# EAGLE design CCR2 (EAGLE 7.1.0)
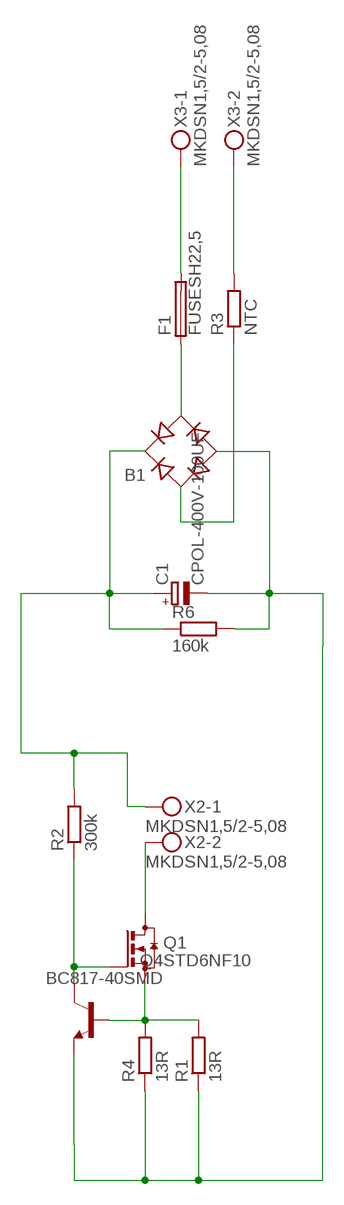
[diagram p0: schematic, sheet 1]

## Parts
B1  RB1A  [RB1A]
C1  CPOL-400V-100UF  [18*36.5_7.62]
F1  FUSESH22,5  [SH22,5]
Q1  STD6NF10  [DPAK]
Q4  BC817-40SMD  [SOT23-BEC]
R1  13R  R-EU_0411/12  [0411/12]
R2  300k  R-EU_0411/12  [0411/12]
R3  NTC  R-EU_0309/10  [0309/10]
R4  13R  R-EU_0411/12  [0411/12]
R6  160k  R-EU_0204/7  [0204/7]
X2  MKDSN1,5/2-5,08  [MKDSN1,5/2-5,08]
X3  MKDSN1,5/2-5,08  [MKDSN1,5/2-5,08]

## Nets
GND: B1.- C1.P$1(-) Q4.E R1.1 R4.1 R6.2
N$1: B1.+ C1.P$2(+) R2.2 R6.1 X2.1
N$2: R3.2 X3.2
N$3: Q1.S Q4.B R1.2 R4.2
N$4: Q1.D X2.2
N$5: F1.2 X3.1
N$6: B1.AC2 F1.1
N$8: Q1.G Q4.C R2.1
N$11: B1.AC1 R3.1

## Library data of the parts
B1 = rectifier:RB1A: RECTIFIER 1 A
C1 = Namenlos:CPOL-400V-100UF
F1 = fuse:FUSE: Fuse; OC_FARNELL: unknown; OC_NEWARK: unknown
Q1 = Namenlos:STD6NF10
Q4 = transistor-npn:BC817*: NPN Transistor
R1-R4 R6 = rcl:R-EU_: RESISTOR, European symbol
X2 X3 = con-phoenix-508:MKDSN1,5/2-5,08: MKDSN 1,5/ 2-5,08 Printklemme Nennstrom: 13,5 A Nennspannung: 250 V Rastermaß: 5,08 mm Polzahl: 2 Anschlussart: Schraubanschluss Montage: Löten Anschlussrichtung Leiter/Platine: 0 ° Artikelnummer: 1729128 Source: http://eshop.phoenixcontact.com .. 1729128.pdf

## Board
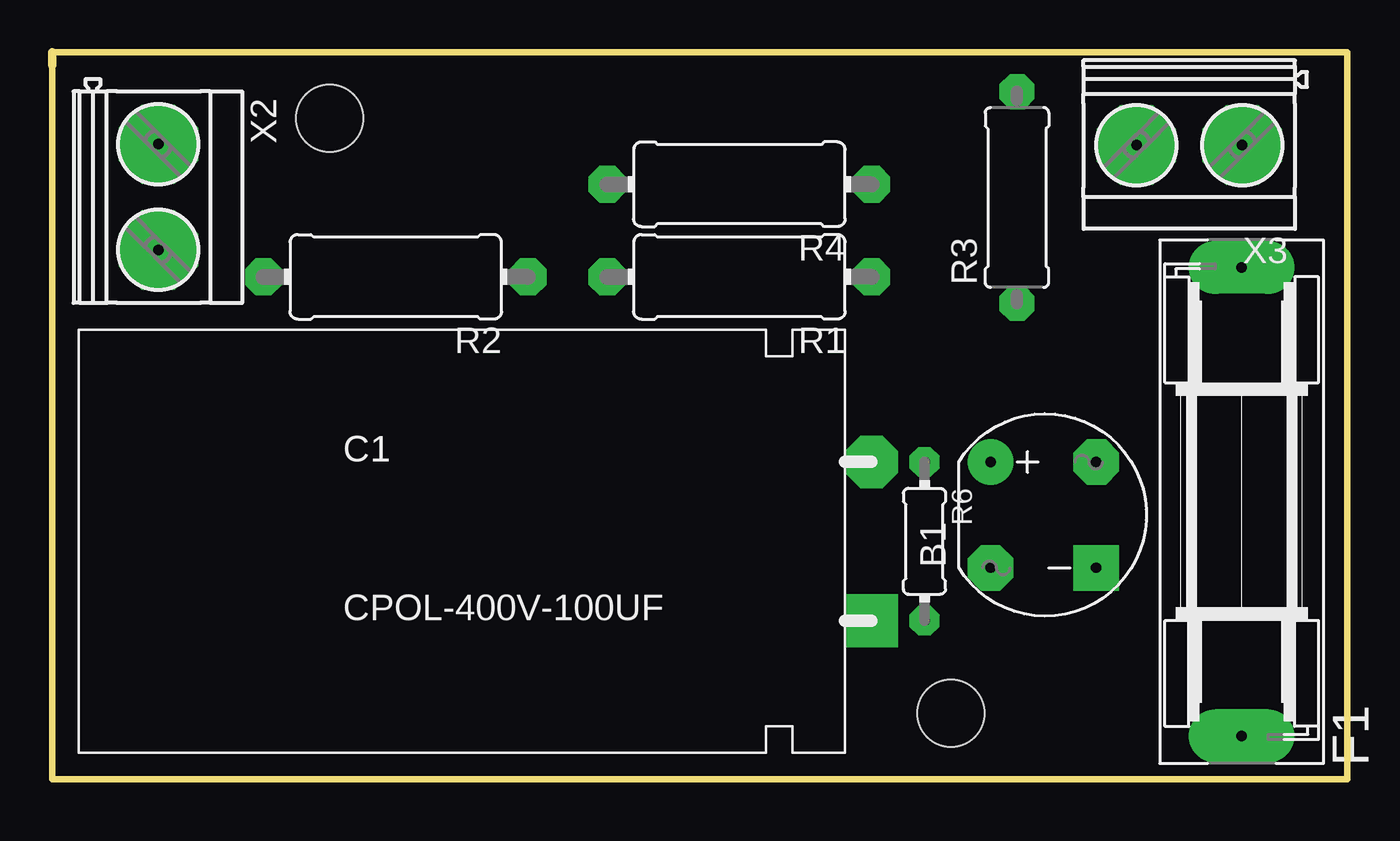
[diagram p1: board, top side]
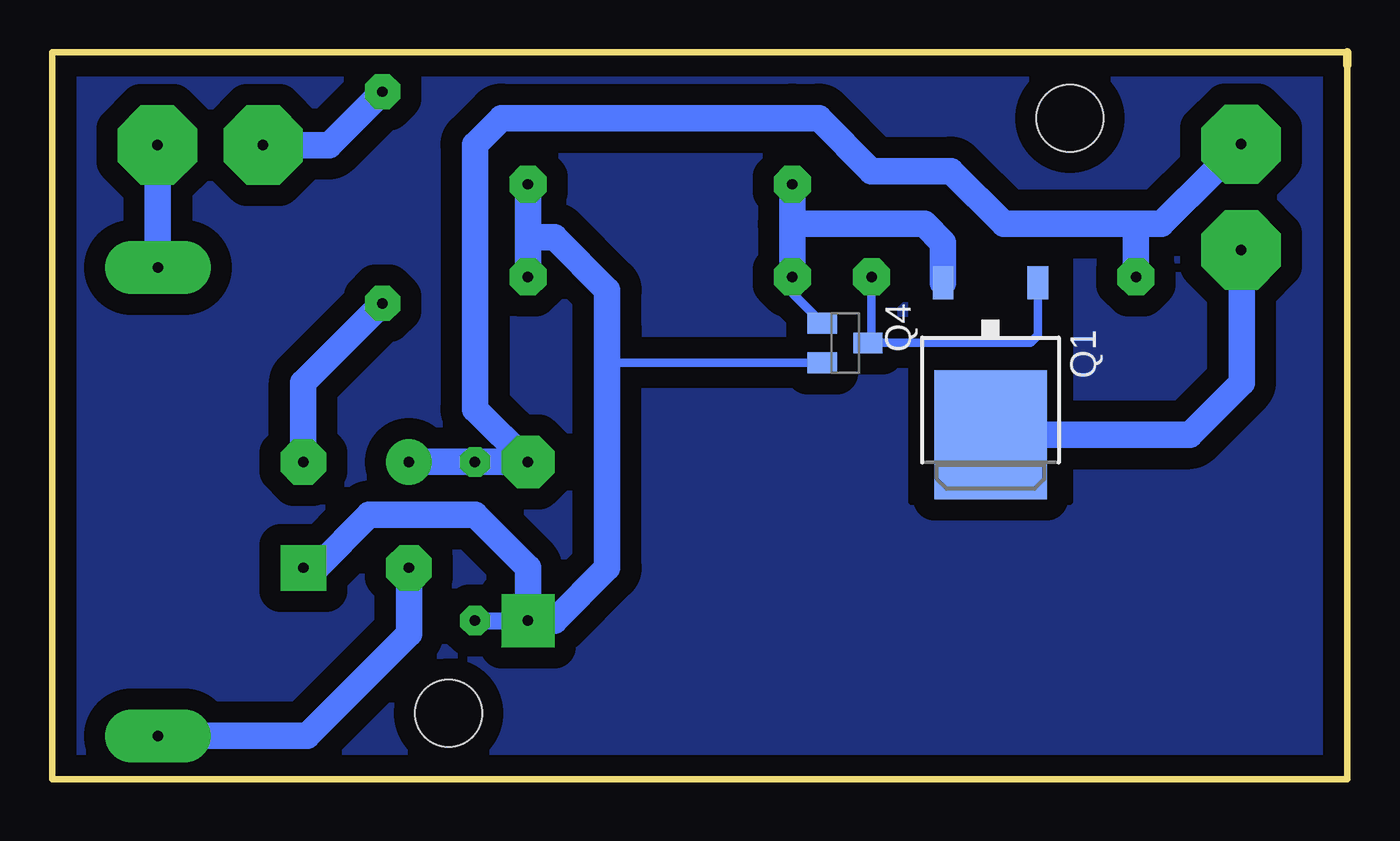
[diagram p2: board, bottom side, seen from below]

Size 62.23 x 34.92 mm. Coordinates in mm from the lower left corner, seen from the top.
Outline: 0,34.29 0,34.92
Outline: 0,34.92 0,34.29
Outline: 0,34.29 0,0 62.23,0 62.23,34.92 0,34.92
Outline: 0,34.92 0,34.29
Copper layers (1*16): Top 0.035mm / dielectric 1.5mm / Bottom 0.035mm
Design rules "default": minimum track width 10mil, minimum drill 24mil, track to track 8mil, track to pad 8mil, pad to pad 8mil, via to via 8mil, smd to smd 8mil, copper to edge 40mil, drill to drill 8mil, minimum pad ring 10mil, minimum via ring 8mil, stop-mask expansion 4mil, vias tented up to drill 0mil, thermal gap 10mil
Holes 3.2 mm at 43.18,3.17 13.33,31.75

### Footprints (pad centres in the part's own frame; a part is rotated, then mirrored left to right if it is on the bottom)
RB1A = drill 0.5 pad 2.184: + -2.54,2.54 | drill 0.5 pad 2.184 square: - 2.54,-2.54 | drill 0.5 pad 2.184 octagon: AC1 2.54,2.54; AC2 -2.54,-2.54
18*36.5_7.62 = drill 0.5 pad 2.54 square: P$1 0,-3.81 | drill 0.5 pad 2.54 octagon: P$2 0,3.81
SH22,5 = drill 0.5 pad 2.54 long: 1 -11.252,0; 2 11.252,0
DPAK = smd 5.4 x 6.2: D 0,2.5 | smd 1 x 1.6: G -2.28,-4.8; S 2.28,-4.8
SOT23-BEC = smd 1 x 1.4: B -0.95,-1.1; C 0,1.1; E 0.95,-1.1
0411/12 = drill 0.5 pad 1.778 octagon: 1 -6.35,0; 2 6.35,0
0309/10 = drill 0.5 pad 1.676 octagon: 1 -5.08,0; 2 5.08,0
0204/7 = drill 0.5 pad 1.422 octagon: 1 -3.81,0; 2 3.81,0
MKDSN1,5/2-5,08 = drill 0.5 pad 3.81 octagon: 1 -2.561,0.025; 2 2.519,0.025

### Placement (x,y rotation side)
B1  47.62,12.7 0 top
C1  39.37,11.43 0 top
F1  57.15,13.34 90 top
Q1  17.14,19.05 180 bottom
Q4  24.13,20.95 270 bottom
R1  33.02,24.13 180 top
R2  16.51,24.13 180 top
R3  46.36,27.94 90 top
R4  33.02,28.57 180 top
R6  41.91,11.43 270 top
X2  5.08,27.94 270 top
X3  54.61,30.48 180 top

### Tracks (layer width: path | path; a pad name or v marks a point on that pad's centre or on a via)
GND
  Bottom 0.406: Q4.E 35.25,20 35.56,20.32
  Bottom 0.813: R6.2 C1.P$1 38.1,7.62
  Bottom 1.27: R4.1 39.37,26.04 | 39.37,26.04 R1.1 | 38.1,7.62 35.56,10.16 35.56,20.32 35.56,21.59 35.56,23.49 38.1,26.04 39.37,26.04 | B1.- 49.53,10.16 46.99,12.7 41.91,12.7 39.37,10.16 C1.P$1
N$1
  Bottom 0.813: C1.P$2 R6.1
  Bottom 1.27: B1.+ C1.P$2 41.91,17.78 41.91,30.48 40.64,31.75 26.67,31.75 25.4,31.75 22.86,29.21 19.05,29.21 16.51,26.67 10.16,26.67 | 5.13,30.48 X2.1 6.4,29.21 8.94,26.67 10.16,26.67 | R2.2 10.16,26.67
N$2
  Bottom 1.27: R3.2 48.92,30.45 X3.2
N$3
  Bottom 0.406: R1.2 26.67,23.34 Q4.B
  Bottom 1.27: R4.2 26.67,26.67 | 26.67,26.67 R1.2 | Q1.S 19.43,25.77 20.32,26.67 26.67,26.67
N$4
  Bottom 1.27: Q1.D 7.58,16.55 5.08,19.05 5.08,25.4 X2.2
N$5
  Bottom 1.27: X3.1 57.15,30.43 F1.2
N$6
  Bottom 1.27: F1.1 49.99,2.08 45.09,6.99 B1.AC2
N$7
  cutout Bottom (isolate 0.61): 20.95,13.34 13.33,13.34 13.33,25.4 20.95,25.4
N$8
  Bottom 0.406: Q1.G 14.86,21.33 15.24,20.95 Q4.C 22.86,21.12 R2.1
N$9
  pour Bottom (isolate 1.016): 0,0 62.23,0 62.23,35.56 0,35.56
N$11
  Bottom 1.27: B1.AC1 50.16,19.05 R3.1